# EAGLE design Translator (EAGLE 7.6.0)
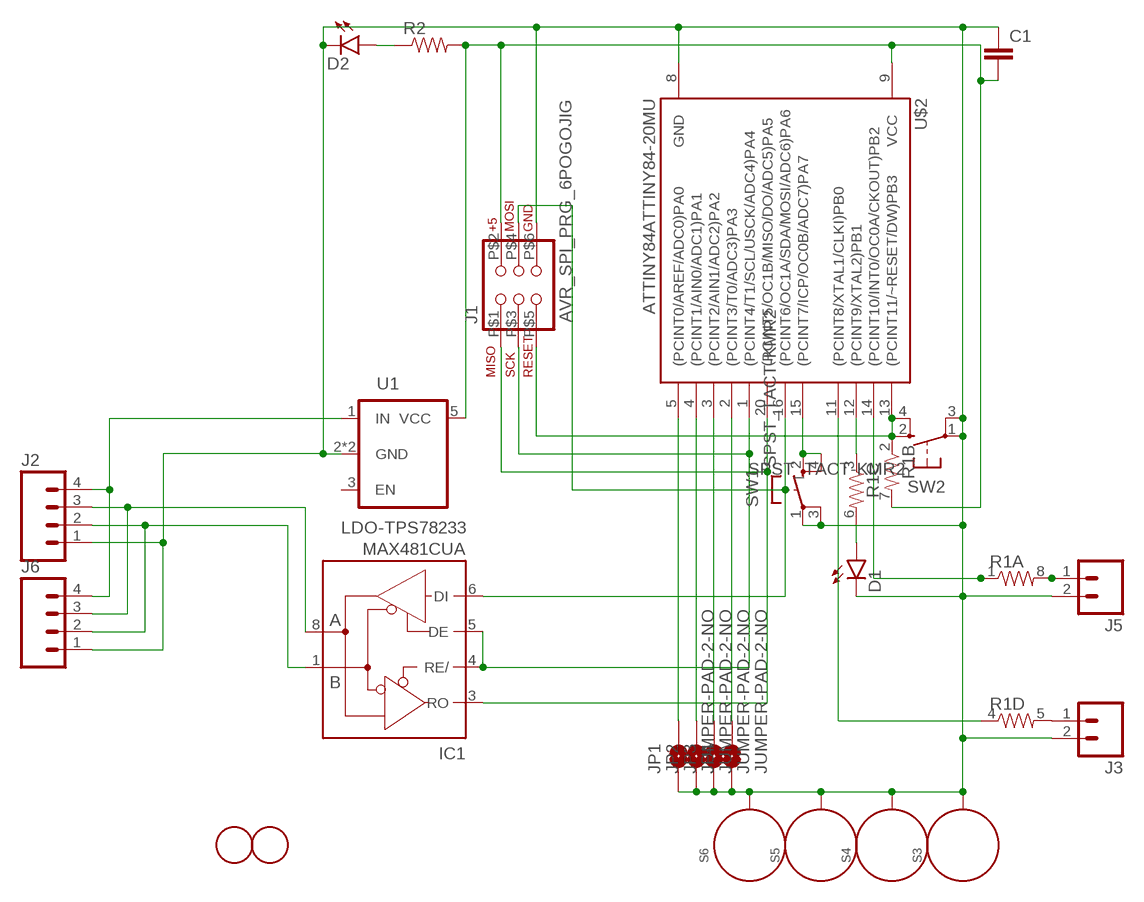
[diagram p0: schematic, sheet 1]

## Parts
C1  CAP0805  [0805]
D1  LED1206  [LED-1206]
D2  LED1206  [LED-1206]
IC1  MAX481CUA  [UMAX8]
J1  AVR_SPI_PRG_6POGOJIG  [2X3_MAX]
J2  M04SCREW  [SCREWTERMINAL-3.5MM-4]
J3  M025MM  [SCREWTERMINAL-5MM-2]
J5  M025MM  [SCREWTERMINAL-5MM-2]
J6  M04SCREW  [SCREWTERMINAL-3.5MM-4]
JP1  JUMPER-PAD-2-NO  [PAD-JUMPER-2-NO_NO_SILK]
JP2  JUMPER-PAD-2-NO  [PAD-JUMPER-2-NO_NO_SILK]
JP3  JUMPER-PAD-2-NO  [PAD-JUMPER-2-NO_NO_SILK]
JP4  JUMPER-PAD-2-NO  [PAD-JUMPER-2-NO_NO_SILK]
R1  RESISTOR-ARRAY0603-ARV  [0603-ARV]
R2  RESISTOR0805-RES  [0805]
S3  STANDOFF_ELECTRICAL  [STANDOFF-ELECTRICAL]
S4  STANDOFF_ELECTRICAL  [STANDOFF-ELECTRICAL]
S5  STANDOFF_ELECTRICAL  [STANDOFF-ELECTRICAL]
S6  STANDOFF_ELECTRICAL  [STANDOFF-ELECTRICAL]
SW1  SPST_TACT-KMR2  [KMR2]
SW2  SPST_TACT-KMR2  [KMR2]
U1  LDO-TPS78233  [SOT23-5]
U$2  ATTINY84ATTINY84-20MU  [QFN20]
U$3  FIDUCIAL  [FIDUCIAL_1MM]
U$4  FIDUCIAL  [FIDUCIAL_1MM]

## Nets
485A: IC1.8(A) J2.3 J6.3
485B: IC1.1(B) J2.2 J6.2
FLOW: IC1.4(RE/) IC1.5(DE) J1.P$3(SCK) U$2.1((PCINT4/T1/SCL/USCK/ADC4)PA4)
GND: C1.1 D1.C D2.C J1.P$6(GND) J2.1 J3.2 J5.2 J6.1 JP1.1 JP2.1 JP3.1 JP4.1 S3.P1 S4.P1 S5.P1 S6.P1 SW1.1(P) SW1.3(P1) SW2.1(P) SW2.3(P1) U1.2(GND) U1.4(GND) U$2.8(GND)
N$1: JP1.2 U$2.5((PCINT0/AREF/ADC0)PA0)
N$2: R1.3 U$2.12((PCINT9/XTAL2)PB1)
N$3: J3.1 R1.5
N$4: JP2.2 U$2.4((PCINT1/AIN0/ADC1)PA1)
N$5: J5.1 R1.8
N$6: JP3.2 U$2.3((PCINT2/AIN1/ADC2)PA2)
N$7: JP4.2 U$2.2((PCINT3/T0/ADC3)PA3)
N$8: D1.A R1.6
N$9: SW1.2(S) SW1.4(S1) U$2.15((PCINT7/ICP/OC0B/ADC7)PA7)
N$10: D2.A R2.1
OUT1: R1.1 U$2.14((PCINT10/INT0/OC0A/CKOUT)PB2)
OUT3: R1.4 U$2.11((PCINT8/XTAL1/CLKI)PB0)
RST: J1.P$5(RESET) R1.2 SW2.2(S) SW2.4(S1) U$2.13((PCINT11/~RESET/DW)PB3)
RX: IC1.3(RO) J1.P$1(MISO) U$2.20((PCINT5/OC1B/MISO/DO/ADC5)PA5)
TX: IC1.6(DI) J1.P$4(MOSI) U$2.16((PCINT6/OC1A/SDA/MOSI/ADC6)PA6)
VCC: C1.2 J1.P$2(VIN) R1.7 R2.2 U1.5(VCC) U$2.9(VCC)
VIN: J2.4 J6.4 U1.1(IN)
Unconnected: U1.3(EN)

## Power pins joined to a net without a drawn wire
GND: IC1.7(GND)
VCC: IC1.2(VCC)

## Library data of the parts
C1 = SparkFun-Capacitors:CAP: Capacitor Standard 0603 ceramic capacitor, and 0.1" leaded capacitor.
D1 D2 = SparkFun-LED:LED: LEDs Standard schematic elements and footprints for 5mm, 3mm, 1206, and 0603 sized LEDs. 5mm - Spark Fun Electronics SKU : COM-00529 (and others)
IC1 = maxim:MAX481CUA: RS485 TRANSEIVER; MPN: MAX481CUA+; OC_FARNELL: unknown; OC_NEWARK: 71P2381
J1 = SparkFun-Connectors:AVR_SPI_PRG_6: AVR ISP 6 Pin This is the reduced ISP connector for AVR programming. Common on Arduino. This footprint will take up less PCB space and can be used with a 10-pin to 6-pin adapter such as SKU: BOB-08508 **Special note about "TEST_POINT" package. The stop mask is on the top side, so if you want your programming test points to be on the bottom of your board, make sure to place this package on the bottom side of the board. This also ensure that the orientation to program from the bottom side will be correct.
J2 J6 = SparkFun-Connectors:M04: Header 4 Standard 4-pin 0.1" header. Use with straight break away headers (SKU : PRT-00116), right angle break away headers (PRT-00553), swiss pins (PRT-00743), machine pins (PRT-00117), and female headers (PRT-00115). Molex polarized connector foot print use with SKU : PRT-08231 with associated crimp pins and housings. 1MM SMD Version SKU: PRT-10208; PROD_ID: Combine 2x8399
J3 J5 = SparkFun-Connectors:M02: Standard 2-pin 0.1" header. Use with - straight break away headers ( PRT-00116) - right angle break away headers (PRT-00553) - swiss pins (PRT-00743) - machine pins (PRT-00117) - female headers (PRT-00115) Molex polarized connector foot print use with: PRT-08233 with associated crimp pins and housings. 2.54_SCREWTERM for use with PRT-10571. 3.5mm Screw Terminal footprints for PRT-08084 5mm Screw Terminal footprints for use with PRT-08432; STOREFRONT_ID: PRT-08432
JP1-JP4 = SparkFun-Passives:JUMPER-PAD-2-NO
R1 = SparkFun-Resistors:RESISTOR-ARRAY: Array Chip Resistor Source: RS Component / Phycomp
R2 = SparkFun-Resistors:RESISTOR: Resistor Basic schematic elements and footprints for 0603, 1206, and PTH resistors.
S3-S6 = SparkFun-Electromechanical:STANDOFF_ELECTRICAL: A standoff intended to be an electrically connected point. Pad size and stop size allow for a #4 Phillips pan screw head to make a solid connection to the board.
SW1 SW2 = adafruit:SPST_TACT: SMT 6mm switch, EVQQ2 series http://www.ladyada.net/library/eagle
U1 = SparkFun-PowerIC:LDO-TPS78233: Voltage Regulator LDO 500nA Ground Current, 150mA, Ultra-Low Quiescent Current Low-Dropout Linear Regulator.
U$2 = SparkFun-DigitalIC:ATTINY84: Atmel 14-pin 2/4/8kB flash uC
U$3 U$4 = adafruit:FIDUCIAL: For use by pick and place machines to calibrate the vision/machine, 1mm By microbuilder.eu

## Board
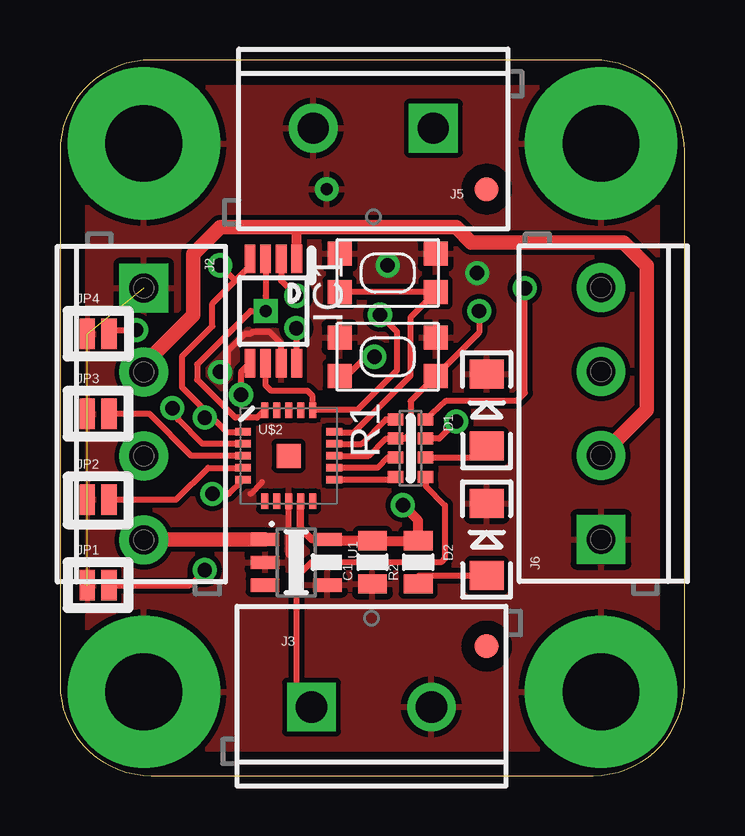
[diagram p1: board, top side]
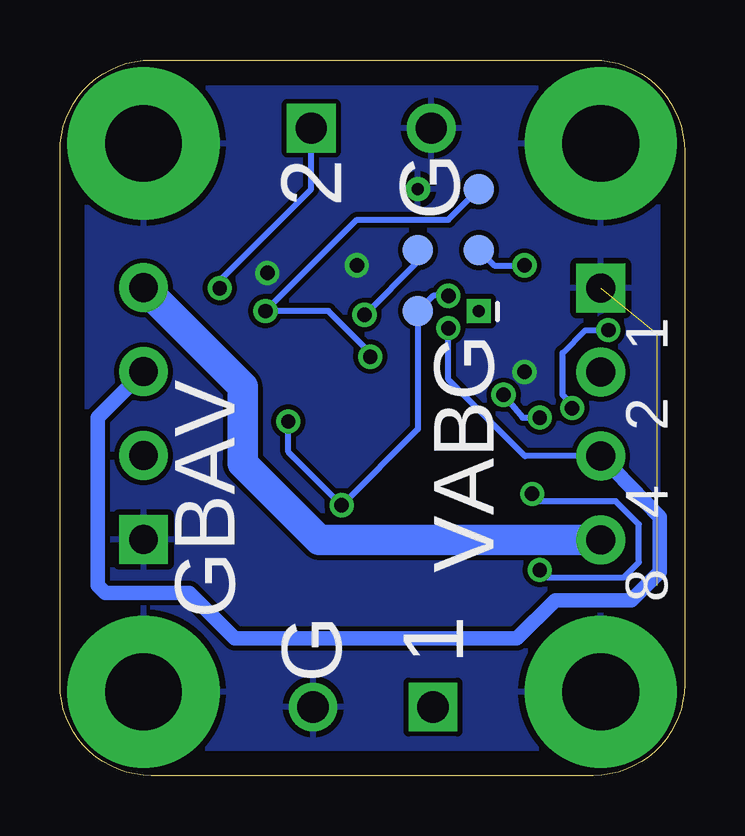
[diagram p2: board, bottom side, seen from below]

Size 26.02 x 29.84 mm. Coordinates in mm from the lower left corner, seen from the top.
Outline: 0,26.03 0,3.81 arc90 3.81,0 22.21,0 arc90 26.02,3.81 26.02,26.03 arc90 22.21,29.83 3.81,29.83 arc90 0,26.03
Copper layers (1*16): Top 0.035mm / dielectric 1.5mm / Bottom 0.035mm
Design rules "default *": minimum track width 10mil, minimum drill 24mil, track to track 8mil, track to pad 8mil, pad to pad 8mil, via to via 8mil, smd to smd 8mil, copper to edge 40mil, drill to drill 8mil, minimum pad ring 10mil, minimum via ring 8mil, stop-mask expansion 4mil, vias tented up to drill 25mil, thermal gap 10mil

### Footprints (pad centres in the part's own frame; a part is rotated, then mirrored left to right if it is on the bottom)
0805 = smd 0.8 x 1.2: 1 -0.9,0; 2 0.9,0
LED-1206 = smd 1.2 x 1.4: A -1.5,0; C 1.5,0
UMAX8 = smd 0.45 x 1.2: 1 -0.975,-2.175; 2 -0.325,-2.175; 3 0.325,-2.175; 4 0.975,-2.175; 5 0.975,2.175; 6 0.325,2.175; 7 -0.325,2.175; 8 -0.975,2.175
2X3_MAX = drill 0.508 square: P$1 -2.54,-1.27 | smd 1.27 x 1.27: P$2 -2.54,1.27; P$3 0,-1.27; P$4 0,1.27; P$5 2.54,-1.27 | drill 0.508: P$6 2.54,1.27
SCREWTERMINAL-3.5MM-4 = drill 1.2 pad 2.032 square: 1 0,0 | drill 1.2 pad 2.032: 2 3.5,0; 3 7,0; 4 10.5,0
SCREWTERMINAL-5MM-2 = drill 1.3 pad 2.032 square: 1 0,0 | drill 1.3 pad 2.032: 2 5,0
PAD-JUMPER-2-NO_NO_SILK = smd 0.635 x 1.27: 1 -0.45,0; 2 0.45,0
0603-ARV = smd 0.5 x 0.65: 1 -1.2,-0.625; 2 -0.4,-0.625; 3 0.4,-0.625; 4 1.2,-0.625; 5 1.2,0.625; 6 0.4,0.625; 7 -0.4,0.625; 8 -1.2,0.625
STANDOFF-ELECTRICAL = drill 3.2 pad 6.35: P1 0,0
KMR2 = smd 1 x 1: 1 2,0.8; 2 2,-0.8; 3 -2,0.8; 4 -2,-0.8
SOT23-5 = smd 0.55 x 1.2: 1 -0.95,-1.3; 2 0,-1.3; 3 0.95,-1.3; 4 0.95,1.3; 5 -0.95,1.3
QFN20 = smd 1 x 1: 0 0,0 | smd 0.65 x 0.3: 1 -1.9,1; 2 -1.9,0.5; 3 -1.9,0; 4 -1.9,-0.5; 5 -1.9,-1; 11 1.9,-1; 12 1.9,-0.5; 13 1.9,0; 14 1.9,0.5; 15 1.9,1 | smd 0.3 x 0.65: 6 -1,-1.9; 7 -0.5,-1.9; 8 0,-1.9; 9 0.5,-1.9; 10 1,-1.9; 16 1,1.9; 17 0.5,1.9; 18 0,1.9; 19 -0.5,1.9; 20 -1,1.9
FIDUCIAL_1MM = smd 1 x 1: 1 0,0

### Placement (x,y rotation side)
C1  13.02,8.89 90 top
D1  17.78,15.24 90 top
D2  17.78,9.84 90 top
IC1  8.89,19.37 180 top
J1  9.84,21.91 90 bottom
J2  3.49,20.32 270 top
J3  10.48,2.86 0 top
J5  15.56,26.99 180 top
J6  22.54,9.84 90 top
JP1  1.59,7.94 0 top
JP2  1.59,11.51 0 top
JP3  1.59,15.08 0 top
JP4  1.59,18.42 0 top
R1  14.6,13.65 270 top
R2  14.92,8.89 90 top
S3  22.54,26.35 0 top
S4  22.54,3.49 0 top
S5  3.49,3.49 0 top
S6  3.49,26.35 0 top
SW1  13.65,20.96 0 top
SW2  13.65,17.46 0 top
U1  9.84,8.89 270 top
U$2  9.52,13.33 0 top
U$3  17.78,5.4 0 top
U$4  17.78,24.45 0 top

### Tracks (layer width: path | path; a pad name or v marks a point on that pad's centre or on a via)
485A  (via drill 0.6)
  Top 0.254: v9.84,18.65 9.84,17.21 IC1.8
  Bottom 0.254: J2.3 6.65,13.32 9.84,16.51 v9.84,18.65
  Bottom 0.61: J2.3 1.03,10.78 1.03,8.49 2.22,7.3 5.4,7.3 6.99,5.71 18.73,5.71 20.64,7.62 24.13,7.62 24.45,7.94 24.45,14.94 J6.3
485B
  Top 0.406: IC1.1 9.86,22.84 9.84,22.86
  Top 0.61: J6.2 24.45,15.25 24.45,21.27 23.49,22.23 17.14,22.23 16.51,22.86 9.84,22.86 6.67,22.86 5.56,21.75 5.56,19.2 5.55,19.2 3.49,17.14 J2.2
FLOW  (via drill 0.6)
  Top 0.254: 7.3,20.64 6.35,19.69 6.35,18.73 5.08,17.46 5.08,16.19 5.87,15.4 | 7.3,20.64 7.91,21.25 IC1.4 | v6.67,21.27 7.3,20.64 | 5.87,15.4 6.94,14.33 U$2.1 | IC1.5 7.54,16.82 v7.54,15.87 | v6.03,14.92 5.87,15.4
  Bottom 0.254: J1.P$3 7.94,21.27 v6.67,21.27 | v7.54,15.87 6.75,14.92 v6.03,14.92
GND  (via drill 0.6)  (4 unrouted)
  Top 0.254: SW2.1 15.72,18.26 | SW2.3 11.28,18.26 | IC1.7 9.22,18.01 8.73,18.49 8.02,18.49 7.94,18.42 7.7,18.42 6.99,17.7 6.99,17.14 v6.67,16.83 | 9.52,9.21 U$2.8 | 7.94,11.75 8.41,12.22
  other vias: 17.38,20.96 13.65,21.27
  pour Bottom: -0.32,29.21 25.4,29.21 25.4,-0.32 -0.32,-0.32
  pour Top: -0.32,29.21 25.4,29.21 25.4,-0.32 -0.32,-0.32
N$1  (via drill 0.6)
  Top 0.254: JP1.2 5.4,7.94 v6.03,8.57 | v6.35,11.75 7.04,11.75 U$2.5
  Bottom 0.254: v6.03,8.57 5.71,8.25 2.54,8.25 1.91,8.89 1.91,10.48 2.86,11.43 6.03,11.43 v6.35,11.75
N$2
  Top 0.254: 14.2,13.15 R1.3 13.65,13.26 13.23,12.83 U$2.12
N$3
  Top 0.254: R1.5 15.23,12.08 16.03,11.27 16.03,9.05 15.87,8.89 10.48,8.89 9.84,8.25 9.84,3.49 J3.1
N$4
  Top 0.254: JP2.2 4.84,11.51 6.17,12.83 U$2.4
N$5  (via drill 0.6)
  Top 0.254: R1.8 16.09,15.64 19.05,15.64 19.37,15.95 v19.37,20.32
  Bottom 0.254: v19.37,20.32 19.37,20.64 15.56,24.45 J5.1
N$6
  Top 0.254: U$2.3 5.48,13.33 3.73,15.08 JP3.2
N$7  (via drill 0.6)
  Top 0.254: JP4.2 2.2,18.57 v3.18,18.57 | U$2.2 5.93,13.83 4.92,14.84 4.92,15.08 v4.68,15.32
  Bottom 0.254: v4.68,15.32 4.68,15.48 5.08,15.87 5.08,17.62 4.13,18.57 v3.18,18.57
N$8
  Top 0.254: R1.6 17.29,13.25 D1.A
N$9
  Top 0.254: SW1.4 SW1.2 14.6,19.11 14.6,16.67 12.22,14.29 11.47,14.29 U$2.15
N$10
  Top 0.254: R2.1 14.96,8.34 D2.A
OUT1
  Top 0.254: U$2.14 12.57,13.83 13.58,14.85 R1.1
OUT3
  Top 0.254: 14.1,12.33 R1.4 arc-90 14.18,12.33 14.1,12.33 | 14.1,12.33 U$2.11
RST  (via drill 0.6)
  Top 0.254: 14.22,13.97 R1.2 | SW2.2 14.6,15.61 14.6,14.29 14.37,14.05 R1.2 | SW2.4 11.81,16.51 12.76,17.46 v13.1,17.46 | 15.71,16.66 SW2.2 | v17.46,19.37 17.46,18.47 SW2.2 | U$2.13 12.86,13.33 13.57,14.05 14.29,14.05 R1.2
  Bottom 0.254: J1.P$5 9.84,23.18 13.65,23.18 v17.46,19.37 14.84,19.37 13.1,17.62 v13.1,17.46
RX
  Top 0.254: IC1.3 8.57,20.01 J1.P$1 7.94,19.37 5.71,17.14 5.71,16.51 7.3,14.92 8.21,14.92 U$2.20
TX  (via drill 0.6)
  Top 0.254: v13.33,19.21 14.05,18.49 14.05,16.91 12.38,15.24 U$2.16 | U$2.16 | U$2.16 10.53,15.82 10.32,16.03 8.81,16.03 8.57,16.27 IC1.6
  Bottom 0.254: v13.33,19.21 11.11,21.43 J1.P$4
VCC  (via drill 0.6)
  Top 0.254: IC1.2 9.22,20.63 v9.84,20 | v16.51,14.76 15.8,14.05 R1.7
  Top 0.305: U1.5 10.48,9.84 10,10.32 10,11.41 U$2.9
  Top 0.406: U1.5 11.19,9.79 C1.2 R2.2 14.92,10.64 v14.29,11.27
  Bottom 0.254: v9.84,20 10.48,20 J1.P$2 11.11,14.45 v14.29,11.27 16.51,13.49 v16.51,14.76
VIN
  Top 0.61: U1.1 3.51,9.84 J2.4
  Bottom 1.27: J6.4 18.42,16.21 18.42,13.02 15.22,9.82 J2.4

### Text on the board
bPlace: G | 2 | 1 | VABG | GBAV | 2 | 4 | 8 | 1 | G